# Altium project DIOT_PSU_AC_180.PrjPCB
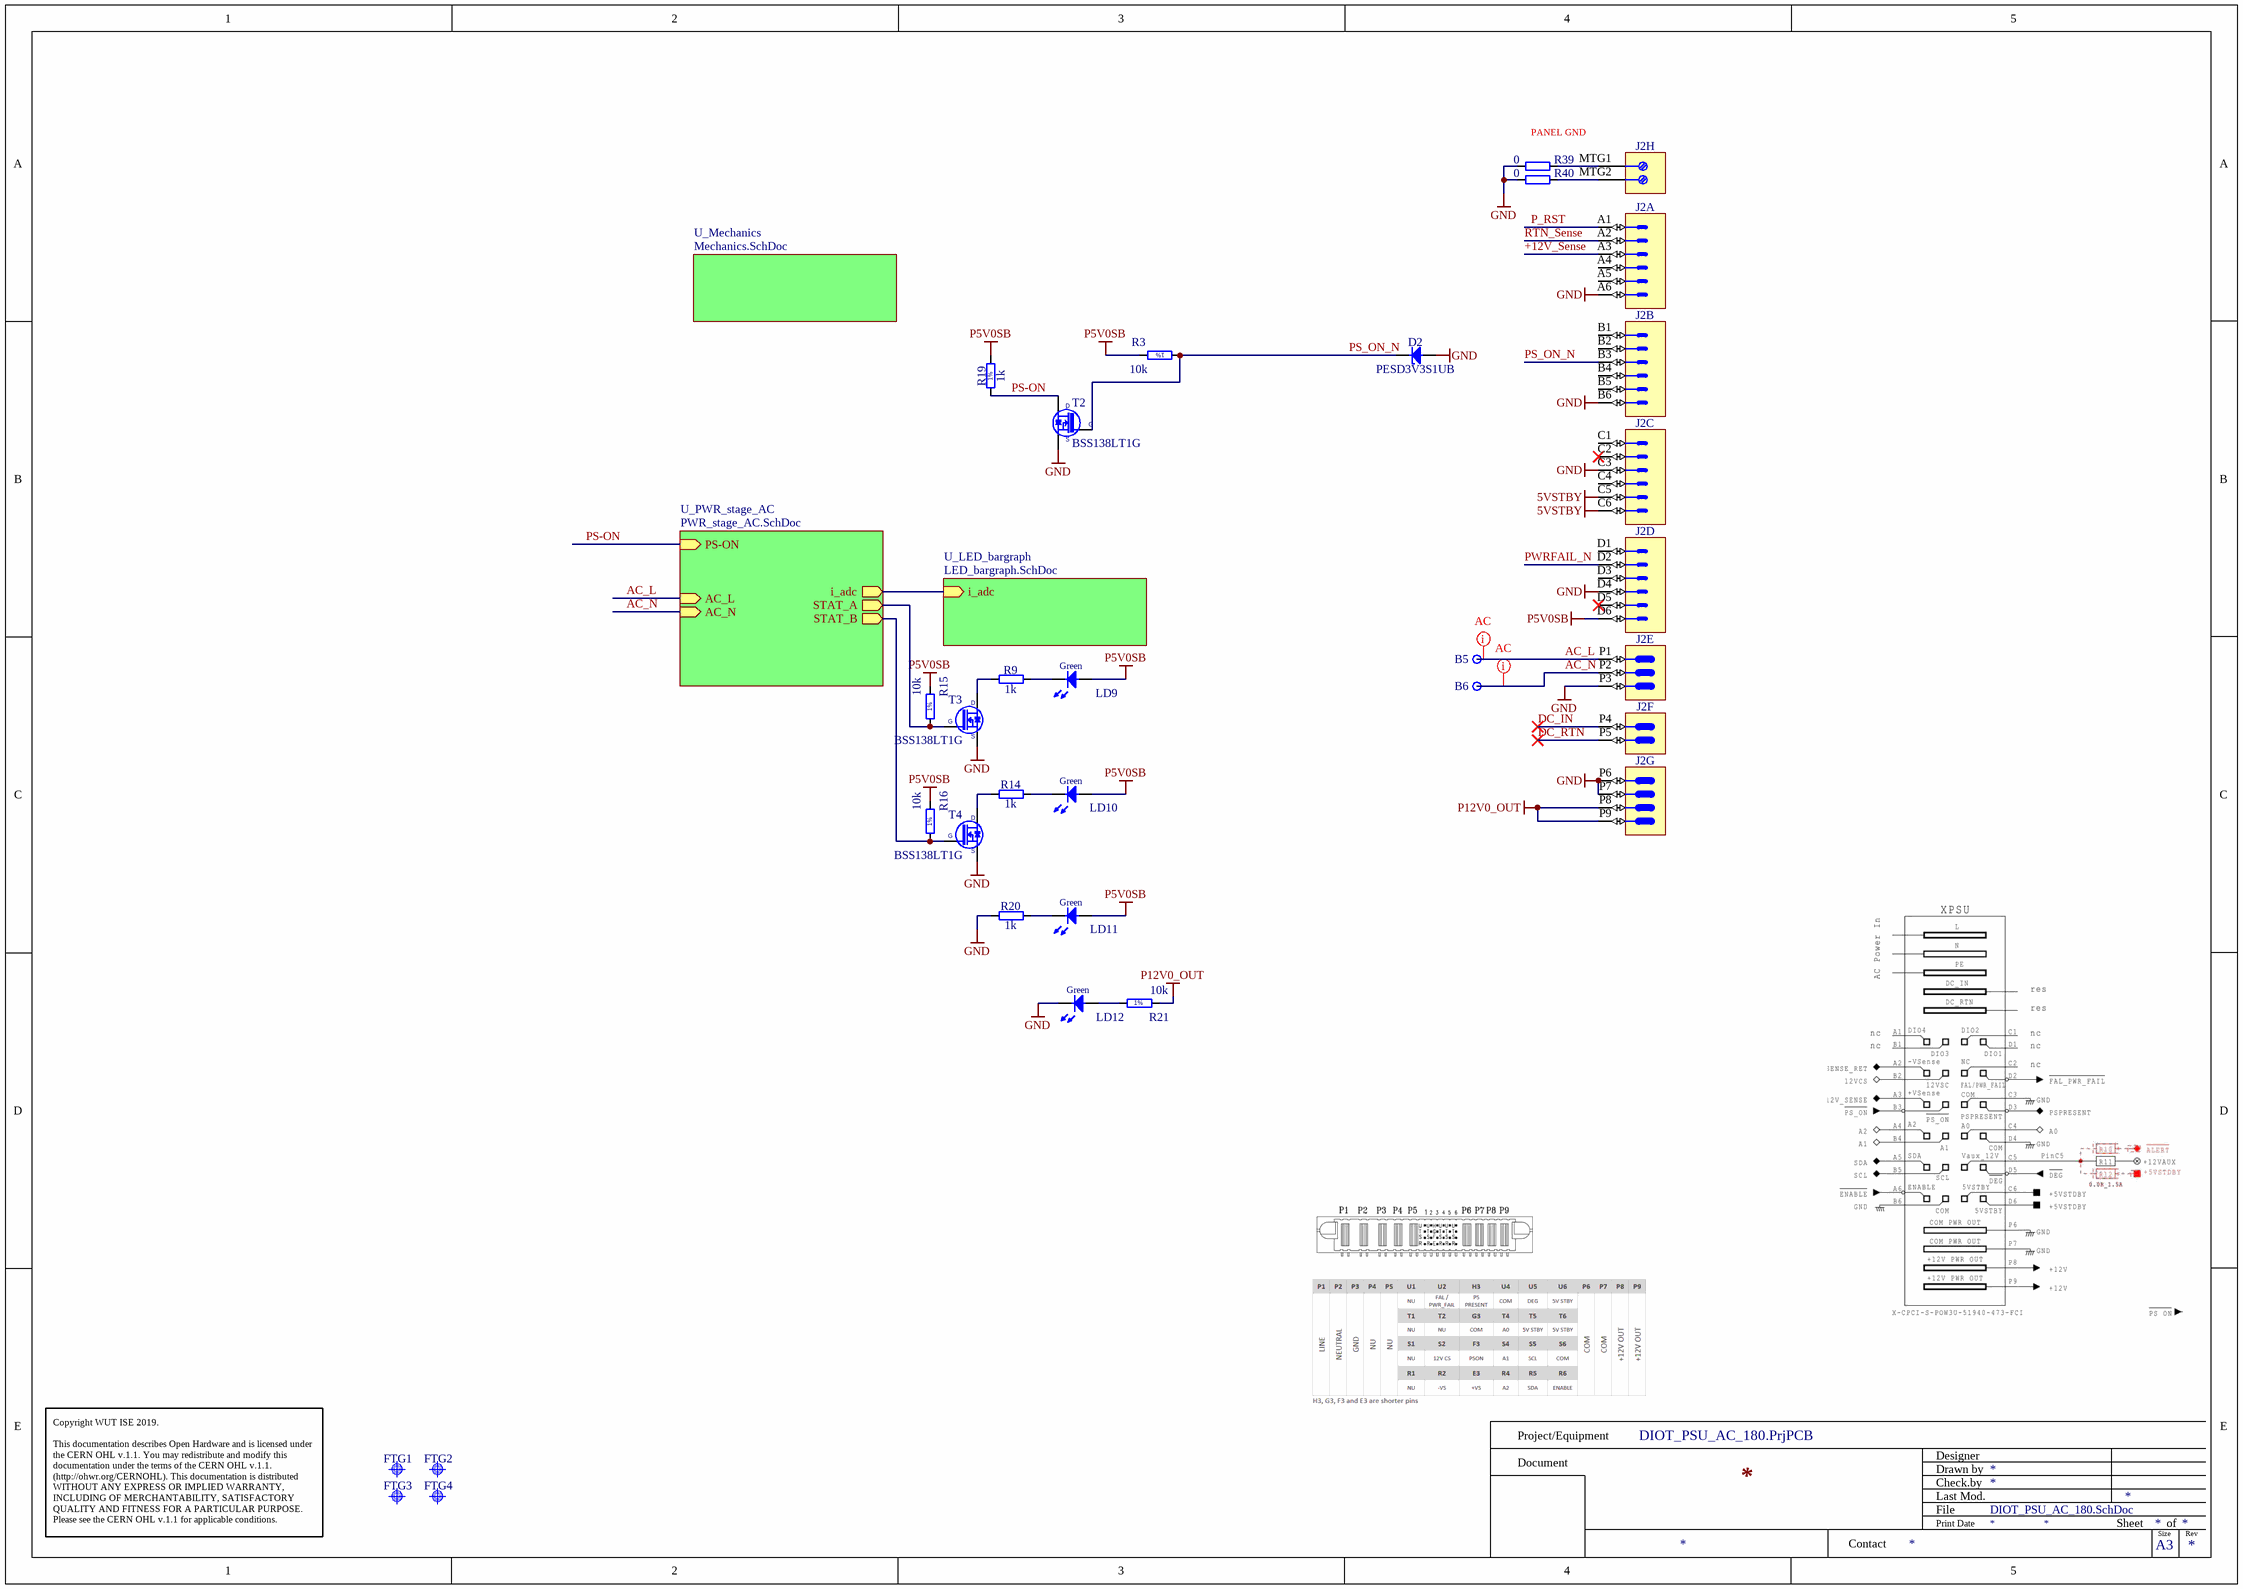
[diagram p0: DIOT_PSU_AC_180.SchDoc]
4 sheets, 97 parts. Net scope: hierarchical (ports join the sheet entries above them; power ports are global).
Board file: DIOT_PSU_AC_180.pcbdoc
Sheets:
  DIOT_PSU_AC_180.SchDoc
    U_PWR_stage_AC = PWR_stage_AC.SchDoc
    U_Mechanics = Mechanics.SchDoc
    U_LED_bargraph = LED_bargraph.SchDoc

## Sheet DIOT_PSU_AC_180.SchDoc
size 420 x 297 mm

### Parts
B5  Plated Hole  [c220h150]  (value not drawn)  (no BOM)
B6  Plated Hole  [c220h150]  (value not drawn)  (no BOM)
D2  PESD3V3S1UB  [SODFL1608X65N]
FTG1  Use only in PCB  [FIDUCIAL_TOP_C100-200]  (value not drawn)
FTG2  Use only in PCB  [FIDUCIAL_TOP_S100-200]  (value not drawn)
FTG3  Use only in PCB  [FIDUCIAL_TOP_C100-200]  (value not drawn)
FTG4  Use only in PCB  [FIDUCIAL_TOP_S100-200]  (value not drawn)
J2  PwrBlade  [AMPHENOL_51939-667]  (value not drawn)  (parts A,B,C,D,E,F,G,H of 8)
LD9  Green  [LED_AVAGO_HSME-C120]
LD10  Green  [LED_AVAGO_HSME-C120]
LD11  Green  [LED_AVAGO_HSME-C120]
LD12  Green  [LED_AVAGO_HSME-C120]
R3  10k  [RESC1005X40N]
R9  1k  [RESC1608X55N]
R14  1k  [RESC1608X55N]
R15  10k  [RESC1005X40N]
R16  10k  [RESC1005X40N]
R19  1k  [RESC1005X40N]
R20  1k  [RESC1608X55N]
R21  10k  [RESC1005X40N]
R39  0  [RESC1608X55N]
R40  0  [RESC1608X55N]
T2  BSS138LT1G  [SOT95P240X110-3N]
T3  BSS138LT1G  [SOT95P240X110-3N]
T4  BSS138LT1G  [SOT95P240X110-3N]

### Sub-sheets
U_LED_bargraph = LED_bargraph.SchDoc: i_adc (in)
U_Mechanics = Mechanics.SchDoc: no entries
U_PWR_stage_AC = PWR_stage_AC.SchDoc: PS-ON (in), i_adc (out), STAT_A (out), STAT_B (out), AC_L (in), AC_N (in)

### Nets
5VSTBY: J2.C5 J2.C6
GND: D2.2(A) J2.A6 J2.B6 J2.C3 J2.D4 J2.P3 J2.P6 J2.P7 LD12.1(C) R20.1 R39.2 R40.2 T2.2(S) T3.2(S) T4.2(S)
P5V0SB: J2.D6 LD9.2(A) LD10.2(A) LD11.2(A) R3.2 R15.2 R16.2 R19.2
P12V0_OUT: J2.P8 J2.P9 R21.2
+12V_Sense: J2.A3
AC_L: B5.1 J2.P1 ; sheet U_PWR_stage_AC/AC_L
AC_N: B6.1 J2.P2 ; sheet U_PWR_stage_AC/AC_N
DC_IN: J2.P4
DC_RTN: J2.P5
i_adc: sheet U_PWR_stage_AC/i_adc, sheet U_LED_bargraph/i_adc
P_RST: J2.A1
PS-ON: R19.1 T2.3(D) ; sheet U_PWR_stage_AC/PS-ON
PS_ON_N: D2.1(C) J2.B3 R3.1 T2.1(G)
PWRFAIL_N: J2.D2
RTN_Sense: J2.A2
NetIC1_4: R15.1 T3.1(G) ; sheet U_PWR_stage_AC/STAT_A
NetIC3_4: R16.1 T4.1(G) ; sheet U_PWR_stage_AC/STAT_B
NetJ2_MTG1: J2.MTG1 R39.1
NetJ2_MTG2: J2.MTG2 R40.1
NetLD9_1: LD9.1(C) R9.2
NetLD10_1: LD10.1(C) R14.2
NetLD11_1: LD11.1(C) R20.2
NetLD12_2: LD12.2(A) R21.1
NetR9_1: R9.1 T3.3(D)
NetR14_1: R14.1 T4.3(D)

Not connected (* = marked no-connect by the designer): J2 A4 A5 B1 B2 B4 B5 C1 C2* C4 D1 D3 D5*

### Layout directives
net class AC: AC_L, AC_N

### Notes on the sheet
- PANEL GND
- Project/Equipment
- Document
- Designer
- Drawn by
- Check.by
- Copyright WUT ISE 2019.
  This documentation describes Open Hardware and is licensed under the CERN OHL v.1.1. You may redistribute and modify this documentation under the terms of the CERN OHL v.1.1. (http://ohwr.org/CERNOHL). This documentation is distributed WITHOUT ANY EXPRESS OR IMPLIED WARRANTY, INCLUDING OF MERCHANTABILITY, SATISFACTORY QUALITY AND FITNESS FOR A PARTICULAR PURPOSE. Please see the CERN OHL v.1.1 for applicable conditions.
- Contact
- File
- Last Mod.
- Print Date
- Sheet
- Size
- A3
- of
- Rev
- (in symbol R0402_1K_1%_0.0625W_100PPM) 1%
- (in symbol R0402_10K_1%_0.0625W_100PPM) 1%

### Library data of the parts
B5 B6 = PLATED_HOLE1.5_PAD2.2: Single Terminal Socket; Part Description: Plated Through Hole: Hole Dia.=1.5mm Pad Dia.=2.2mm, IPC-7251 Level A; Mounted: No; Part Number: PLATED_HOLE1.5_PAD2.2; Component Type: Standard (No BOM); Pin Count: 1; Family: Plated Hole; Socket: No; SMD: No; Sense: No; Status: None; ComponentHeight: 0mm; HelpURL: Undefined; Author: CERN DEM JLC; CreateDate: 11.05.2017; LatestRevisionDate: 11.05.2017; PackageDescription: Plated Through Hole: Hole Dia.=1.5mm Pad Dia.=2.2mm, IPC-7251 Level A
D2 = PESD3V3S1UB: ESD protection diode; Part Description: ESD protection diode (23kV); Manufacturer: NXP SEMICONDUCTORS; Voltage: 3V3; Power: 330W; PressFit: No; Bonding: No; Part Number: PESD3V3S1UB; Component Kind: Standard; Component Type: Standard; Device: PESD3V3S1UB; PackageDescription: Ultra Small Outline Diode Flat Lead (SOD-523), Body; 1.2mm L X 0.8mm W X 0.65mm H, IPC Medium Density; Manufacturer Part Number: PESD3V3S1UB; Pin Count: 2; Case: SOD523; Mounted: Yes; Socket: No; SMD: Yes; Sense: No; ComponentHeight: 0.65mm; HelpURL: \\cern.ch\dfs\Applications\Altium\Datasheets\PESD3V3S1UB.pdf; Author: CERN DEM JLC; CreateDate: 29.11.2012; LatestRevisionDate: 29.11.2012
FTG1 FTG3 = FIDUCIAL_TARGET_C100-200: Fiducial Target; Part Description: Round Fiducial Target, Top Layer, 1.0mm, Top Solder 2.0mm, Keepout =2.0mm; Mounted: No; Part Number: FIDUCIAL_TARGET_C100-200; Component Kind: Standard (No BOM); Component Type: Standard (No BOM); Pin Count: 1; Family: Fiducial; Socket: No; SMD: Yes; Sense: No; Status: None; ComponentHeight: 0mm; HelpURL: Undefined; Author: CERN DEM JLC; CreateDate: 09.02.2010; LatestRevisionDate: 04.04.2012; PackageDescription: Round Fiducial Target, Top Layer, 1.0mm, Top Solder 2.0mm, Keepout =2.0mm
FTG2 FTG4 = FIDUCIAL_TARGET_S100-200: Fiducial Target; Part Description: Square Fiducial Target, Top Layer, 1.0mm, Top Solder 2.0mm, Keepout =2.0mm; Mounted: No; Part Number: FIDUCIAL_TARGET_S100-200; Component Kind: Standard (No BOM); Component Type: Standard (No BOM); Pin Count: 1; Family: Fiducial; Socket: No; SMD: Yes; Sense: No; Status: None; ComponentHeight: 0mm; HelpURL: Undefined; Author: CERN DEM JLC; CreateDate: 09.02.2010; LatestRevisionDate: 04.04.2012; PackageDescription: Square Fiducial Target, Top Layer, 1.0mm, Top Solder 2.0mm, Keepout =2.0mm
J2 = AMPHENOL_51939-667: Thru-Hole, Lead 3.43mm, PowerBlade Right Angled Power Connector 3ACP 2P 24S 4P Contacts; Part Description: Right Angle PowerBlade Power Connector 3ACP + 2P + 24S + 4P Contacts; PressFit: No; Part Number: AMPHENOL_51939-667; Component Kind: Standard; Component Type: Standard; Pin Count: 33; Family: PwrBlade; Mounted: Yes; Socket: No; SMD: No; Sense: No; Status: None; Manufacturer: AMPHENOL; Manufacturer Part Number: 51939-667; ComponentHeight: 12.57mm; HelpURL: \\cern.ch\dfs\Applications\Altium\Datasheets\AMPHENOL_51939-667.pdf; Author: CERN DEM JLC; CreateDate: 05.03.2019; LatestRevisionDate: 05.03.2019
LD9-LD12 = LED_AVAGO_HSME-C120: LED Green 1C 2A; Part Description: High Performance Right Angle Chip Green LED; Manufacturer: AVAGO TECHNOLOGIES; PressFit: No; Bonding: No; Part Number: LED_AVAGO_HSME-C120; Component Kind: Standard; Component Type: Standard; Color: Green; PackageDescription: Green Chip LED, 2-Leads, Body 1.7x1.1mm, Side Emitting Package; Manufacturer Part Number: HSME-C120; Pin Count: 2; Mounted: Yes; Socket: No; SMD: Yes; Sense: No; ComponentHeight: 0.7mm; HelpURL: \\cern.ch\dfs\Applications\Altium\Datasheets\LED_AVAGO_HSME-C120.pdf; ComponentLink1URL: \\cern.ch\dfs\Applications\Altium\Datasheets\LED_AVAGO_HSME-C110_DESIGN-GUIDE.pdf; ComponentLink1Description: Design Guide; Author: CERN DEM JMW; CreateDate: 22.07.2009; LatestRevisionDate: 20.06.2012
R3 R15 R16 R21 = R0402_10K_1%_0.0625W_100PPM: Resistor - 1%; Part Description: General Purpose Thick Film Chip Resistor; Manufacturer: GENERIC; Manufacturer1 Part Number: 232270671003L; TC: ±100ppm/°C; Table: Resistors SMD; Part Number: R0402_10K_1%_0.0625W_100PPM; Component Kind: Standard; Component Type: Standard; Pin Count: 2; Value: 10k; Status: Not recommended; Power: 0.0625W; Tolerance: ±1%; Manufacturer Part Number: R0402_10K_1%_0.0625W_100PPM; Case: 0402; Mounted: Yes; Socket: No; SMD: Yes; Manufacturer1 Example: YAGEO PHYCOMP; Manufacturer1 ComponentHeight: 0.4mm; HelpURL: \\cern.ch\dfs\Applications\Altium\Datasheets\R0402_Phycomp_RC0402.pdf; Author: CERN DEM JLC; CreateDate: 2007-12-03; LatestRevisionDate: 2012-10-17
R9 R14 R20 = R0603_1K_1%_0.1W_100PPM: Resistor - 1%; Part Description: General Purpose Thick Film Chip Resistor; Manufacturer: GENERIC; Manufacturer1 Part Number: NRC06F1001TRF; Power: 0.1W; TC: ±100ppm/°C; PressFit: No; Part Number: R0603_1K_1%_0.1W_100PPM; Component Kind: Standard; Component Type: Standard; Pin Count: 2; Value: 1k; Status: Preferred; Tolerance: ±1%; Manufacturer Part Number: R0603_1K_1%_0.1W_100PPM; Case: 0603; Mounted: Yes; Sense: No; Socket: No; SMD: Yes; Manufacturer1 Example: NIC COMPONENT; Manufacturer1 ComponentHeight: 0.55mm; HelpURL: \\cern.ch\dfs\Applications\Altium\Datasheets\R0603_NIC_NRC.pdf; Author: CERN DEM JLC; CreateDate: 03.12.2007; LatestRevisionDate: 13.03.2008
R19 = R0402_1K_1%_0.0625W_100PPM: Resistor - 1%; Part Description: General Purpose Thick Film Chip Resistor; Manufacturer: GENERIC; Manufacturer1 Part Number: 232270671002L; TC: ±100ppm/°C; PressFit: No; Part Number: R0402_1K_1%_0.0625W_100PPM; Component Kind: Standard; Component Type: Standard; Pin Count: 2; Value: 1k; Status: Not Recommended; Power: 0.0625W; Tolerance: ±1%; Manufacturer Part Number: R0402_1K_1%_0.0625W_100PPM; Case: 0402; Mounted: Yes; Sense: No; Socket: No; SMD: Yes; Manufacturer1 Example: YAGEO PHYCOMP; Manufacturer1 ComponentHeight: 0.4mm; HelpURL: \\cern.ch\dfs\Applications\Altium\Datasheets\R0402_Phycomp_RC0402.pdf; Author: CERN DEM JLC; CreateDate: 03.12.2007; LatestRevisionDate: 17.10.2012
R39 R40 = R0603_0R_JUMPER: Resistor; Part Description: 1A (0.05R Max DC Resistance) Zero Ohm Jumper; Manufacturer: GENERIC; Manufacturer1 Part Number: NRC06Z0; PressFit: No; Part Number: R0603_0R_JUMPER; Component Kind: Standard; Component Type: Standard; Pin Count: 2; Value: 0; Status: Preferred; Manufacturer Part Number: R0603_0R_JUMPER; Case: 0603; Mounted: Yes; Sense: No; Socket: No; SMD: Yes; Manufacturer1 Example: NIC COMPONENT; Manufacturer1 ComponentHeight: 0.55mm; HelpURL: \\cern.ch\dfs\Applications\Altium\Datasheets\R0603_NIC_NRC.pdf; Author: CERN DEM JLC; CreateDate: 03.12.2007; LatestRevisionDate: 13.03.2008
T2-T4 = BSS138LT1G: N-CHANNEL MOSFET WITH DIODE; Part Description: 50V 200mA N-Channel Enhancement Mode Field-Effect Transistor; Manufacturer: ON SEMICONDUCTOR; PressFit: No; Bonding: No; Part Number: BSS138LT1G; Component Kind: Standard; Component Type: Standard; Device: BSS138LT1G; PackageDescription: SOT23 3-Leads, Pitch 0.95mm - Body 1.4x3mm, IPC Medium Density; Manufacturer Part Number: BSS138LT1G; Pin Count: 3; Case: SOT23-3; Mounted: Yes; Socket: No; SMD: Yes; Sense: No; ComponentHeight: 1.11mm; HelpURL: \\cern.ch\dfs\Applications\Altium\Datasheets\BSS138LT1G.pdf; Author: CERN DEM JLC; CreateDate: 23.03.2009; LatestRevisionDate: 23.03.2009

## Sheet PWR_stage_AC.SchDoc
size 420 x 297 mm; SPICEModelCacheMYOJSQKR: <root> / <DocumentId>MYOJSQKR</DocumentId> / <CacheFrame Number="0"> / <Model Name="860080473007_120uf" Kind="CKT"> / <Text>******* / .subckt 860080473007_120uF 1 2 / Rser 1 3 0.1 / Lser 2 4 0.000000005 / C1 3 4 0.00012 / Rpar 3 4 833333.333333333 / .ends 860080473007_120uF</Text> / </Model> / </CacheFrame> / </root>
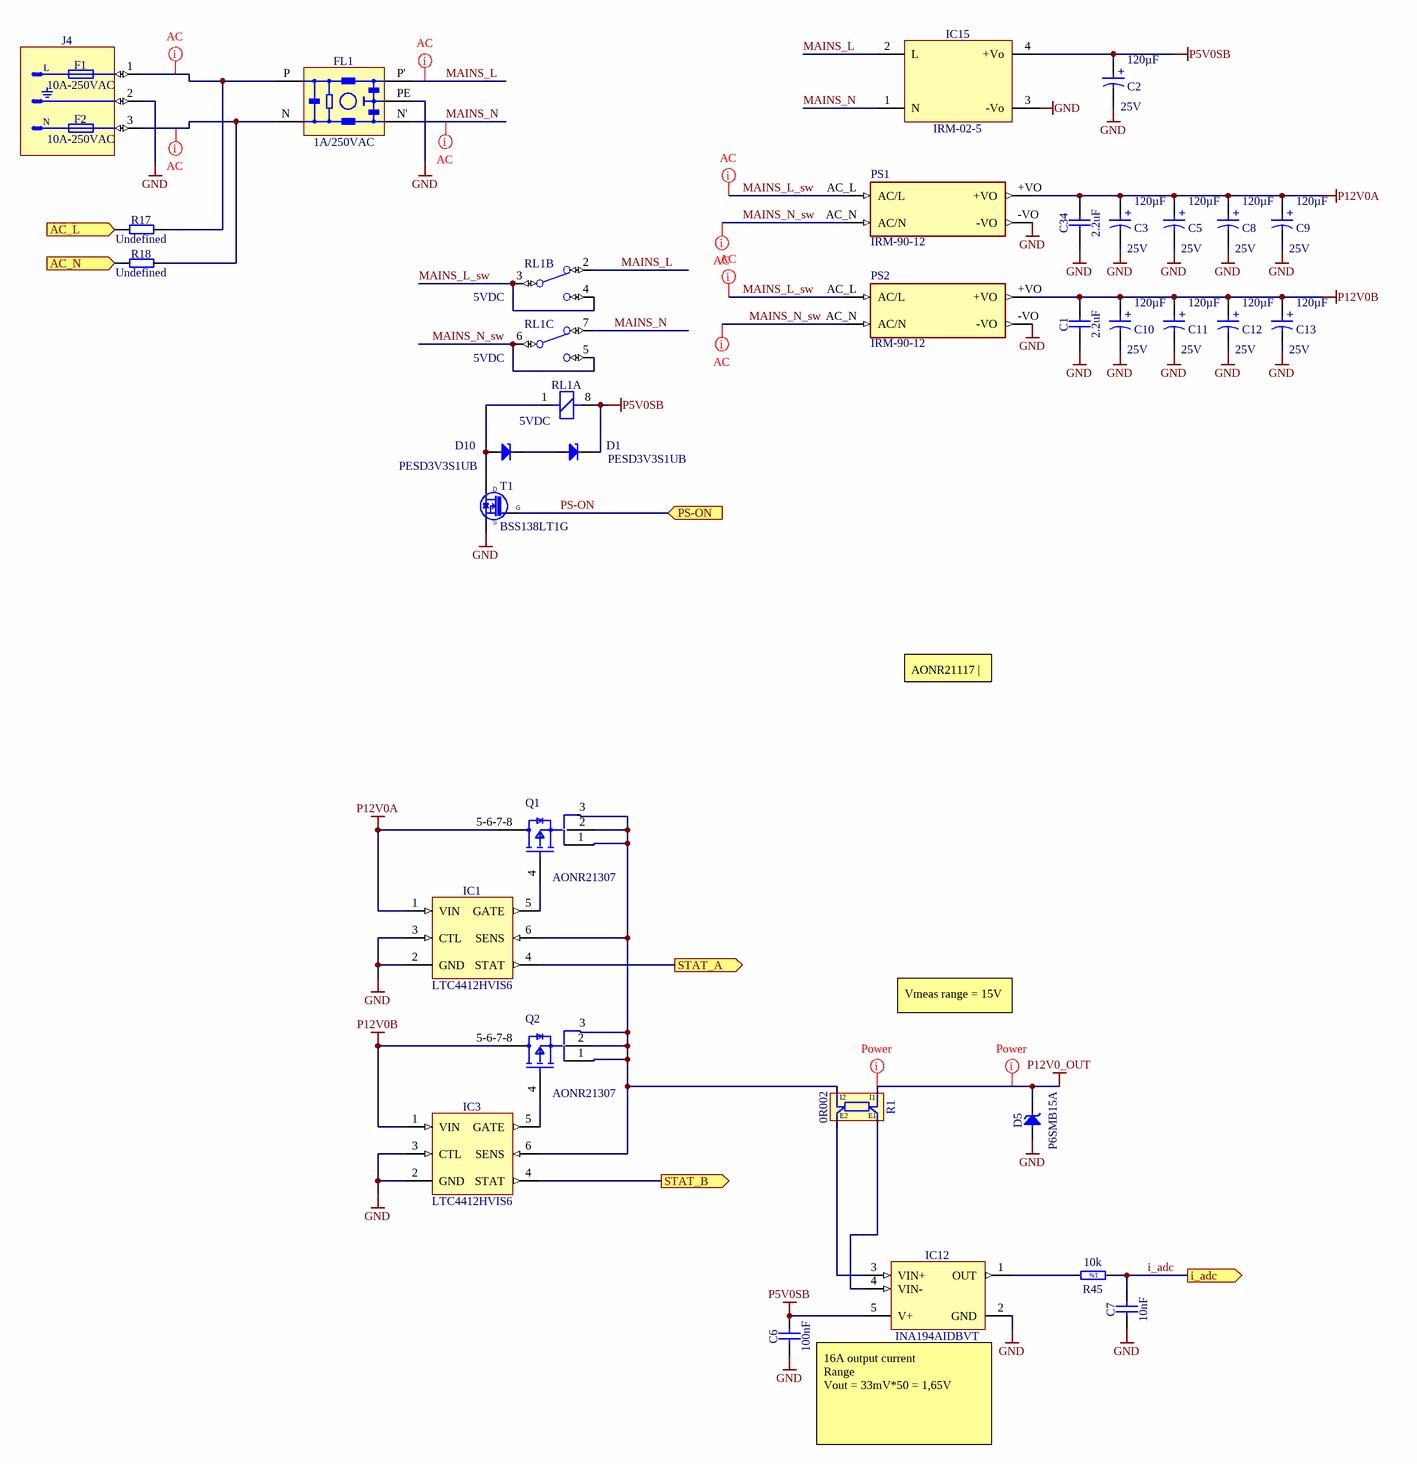
[diagram p1: PWR_stage_AC.SchDoc]

### Parts
C1  2.2uF  [CAPC2013X145N]
C2  Rated Voltage (DC): 25V  [WCAP-ATLI_D6.3H15]  (hidden comment: 120µF)
C3  Rated Voltage (DC): 25V  [WCAP-ATLI_D6.3H15]  (hidden comment: 120µF)
C5  Rated Voltage (DC): 25V  [WCAP-ATLI_D6.3H15]  (hidden comment: 120µF)
C6  100nF  [CAPC1005X55N]
C7  10nF  [CAPC1005X55N]
C8  Rated Voltage (DC): 25V  [WCAP-ATLI_D6.3H15]  (hidden comment: 120µF)
C9  Rated Voltage (DC): 25V  [WCAP-ATLI_D6.3H15]  (hidden comment: 120µF)
C10  Rated Voltage (DC): 25V  [WCAP-ATLI_D6.3H15]  (hidden comment: 120µF)
C11  Rated Voltage (DC): 25V  [WCAP-ATLI_D6.3H15]  (hidden comment: 120µF)
C12  Rated Voltage (DC): 25V  [WCAP-ATLI_D6.3H15]  (hidden comment: 120µF)
C13  Rated Voltage (DC): 25V  [WCAP-ATLI_D6.3H15]  (hidden comment: 120µF)
C34  2.2uF  [CAPC2013X145N]
D1  PESD3V3S1UB  [SODFL1608X65N]
D5  P6SMB15A  [DIOM5436X261N]
D10  PESD3V3S1UB  [SODFL1608X65N]
F1  10A-250VAC  [FUSE_5X20_GLASS_v]
F2  10A-250VAC  [FUSE_5X20_GLASS_v]
FL1  1A/250VAC  [FIL_SCHAFFNER_FN 406]
IC1  LTC4412HVIS6  [SOT95P280X100-6N]
IC3  LTC4412HVIS6  [SOT95P280X100-6N]
IC12  INA194AIDBVT  [SOT95P280X145-5N]
IC15  IRM-02-5  [PWS_MEANWELL_IRM-02]
J4  IEC  [SCHURTER_GSF1.2202.31]  (value not drawn)
PS1  IRM-90-12  [CONV_IRM-90-12]
PS2  IRM-90-12  [CONV_IRM-90-12]
Q1  AONR21307  [FP-DFN3x3A_8L_EP1_P-MFG]
Q2  AONR21307  [FP-DFN3x3A_8L_EP1_P-MFG]
R1  0R002  [RES_VISHAY_WSK2512_0R005-0R2]
R17  Undefined  [RESC6331X70N]
R18  Undefined  [RESC6331X70N]
R45  10k  [RESC1005X40N]
RL1  5VDC  [REL_OMRON_G2RL-2-5DC]  (parts A,B,C of 3)
T1  BSS138LT1G  [SOT95P240X110-3N]

### Ports
AC_L (in), AC_N (in), i_adc (out), PS-ON (in), STAT_A (out), STAT_B (out)

### Nets
GND: C1.1 C2.2(N) C3.2(N) C5.2(N) C6.1 C7.1 C8.2(N) C9.2(N) C10.2(N) C11.2(N) C12.2(N) C13.2(N) C34.1 D5.2(A) FL1.PE IC1.2(GND) IC1.3(CTL) IC3.2(GND) IC3.3(CTL) IC12.2(GND) IC15.3(-Vo) J4.2 PS1.-VO PS2.-VO T1.2(S)
P5V0SB: C2.1(P) C6.2 D1.1(C) IC12.5(V+) IC15.4(+Vo) RL1.8
P12V0_OUT: D5.1(C) R1.I1
P12V0A: C3.1(P) C5.1(P) C8.1(P) C9.1(P) C34.2 IC1.1(VIN) PS1.+VO Q1.5-6-7-8(D)
P12V0B: C1.2 C10.1(P) C11.1(P) C12.1(P) C13.1(P) IC3.1(VIN) PS2.+VO Q2.5-6-7-8(D)
AC_L: R17.1 ; port AC_L
AC_N: R18.1 ; port AC_N
i_adc: C7.2 R45.1 ; port i_adc
MAINS_L: FL1.P' IC15.2(L) RL1.2(NC)
MAINS_L_sw: PS1.AC_L(AC/L) PS2.AC_L(AC/L) RL1.3(C) RL1.4(NO)
MAINS_N: FL1.N' IC15.1(N) RL1.7(NC)
MAINS_N_sw: PS1.AC_N(AC/N) PS2.AC_N(AC/N) RL1.5(NO) RL1.6(C)
PS-ON: T1.1(G) ; port PS-ON
NetD1_2: D1.2(A) D10.1(C)
NetD10_2: D10.2(A) RL1.1 T1.3(D)
NetFL1_N: FL1.N J4.3 R18.2
NetFL1_P: FL1.P J4.1 R17.2
NetIC1_4: IC1.4(STAT) ; port STAT_A
NetIC1_5: IC1.5(GATE) Q1.4(G)
NetIC1_6: IC1.6(SENS) IC3.6(SENS) Q1.1(S) Q1.2(S) Q1.3(S) Q2.1(S) Q2.2(S) Q2.3(S) R1.I2
NetIC3_4: IC3.4(STAT) ; port STAT_B
NetIC3_5: IC3.5(GATE) Q2.4(G)
NetIC12_1: IC12.1(OUT) R45.2
NetIC12_3: IC12.3(VIN+) R1.E2
NetIC12_4: IC12.4(VIN-) R1.E1

### Layout directives
net class Power: P12V0_OUT
net class AC: MAINS_L, MAINS_L_sw, MAINS_N, MAINS_N_sw, NetFL1_N, NetFL1_P

### Notes on the sheet
- AONR21117 | Tranzystor: P-MOSFET; unipolarny; 20V; 26,5A; 5W; DFN8
  AONR21117
- Vmeas range = 15V
- 16A output current
  Range
  Vout = 33mV*50 = 1,65V
- Project/Equipment
- Document
- Designer
- Drawn by
- Check.by
- Copyright WUT ISE 2020.
  This documentation describes Open Hardware and is licensed under the CERN OHL v.1.2. You may redistribute and modify this documentation under the terms of the CERN OHL v.1.2. (http://ohwr.org/CERNOHL). This documentation is distributed WITHOUT ANY EXPRESS OR IMPLIED WARRANTY, INCLUDING OF MERCHANTABILITY, SATISFACTORY QUALITY AND FITNESS FOR A PARTICULAR PURPOSE. Please see the CERN OHL v.1.2 for applicable conditions.
- Contact
- File
- Last Mod.
- Print Date
- Sheet
- Size
- A3
- of
- Rev
- (in symbol 860080473007) +
- (in symbol R0402_10K_1%_0.0625W_100PPM) 1%
- (in symbol SCHURTER_GSF1.2202.31) L; N

### Library data of the parts
C1 C34 = CC0805_2.2UF_35V_10%_X7R_TDK_CGA4J1X7R1V225K125AC: Non-polarised capacitor; Part Description: SMD Multilayer Chip Ceramic Capacitor (Automotive Grade); Manufacturer: TDK; Voltage: 35V; TC: X7R; Tolerance: ±10%; Part Number: CC0805_2.2UF_35V_10%_X7R_TDK_CGA4J1X7R1V225K125AC; Component Kind: Standard; Component Type: Standard; Pin Count: 2; Value: 2.2uF; Status: Not Recommended; Manufacturer Part Number: CGA4J1X7R1V225K125; Case: 0805; Mounted: Yes; Socket: No; SMD: Yes; Sense: No; ComponentHeight: 1.45mm; HelpURL: \\cern.ch\dfs\Applications\Altium\Datasheets\CC0805_X7R_TDK_CGA.pdf; Author: CERN DEM BC; CreateDate: 26.02.2016; LatestRevisionDate: 13.09.2016
C2 C3 C5 C8-C13 = 860080473007: WCAP-ATLI Aluminum Electrolytic Capacitor, Radial, THT, D6.3 x H15mm, 120µF, 25V; Manufacturer: Wurth Elektronik; Capacitance Tolerance: +/-20%; Dissipation Factor: 10%; Endurance: 2000h; Leakage Current: 30µA; Ripple Current: 490mA; Technical Reference: ATED150121M025DSPA4B000; Manufacturer Part Number: 860080473007; Category: Aluminum Electrolytic Capacitors; Match Code: WCAP-ATLI; ComponentLink1Description: Website Link; ComponentLink1URL: https://www.we-online.com/redexpert/article/860080473007?ad; ComponentLink2Description: Datasheet Link; ComponentLink2URL: https://www.we-online.com/redexpert/spec/860080473007?ad; Mount: Through Hole; Operating Temperature Max: 105°C; Operating Temperature Min: -55°C; Packaging: Ammo Pack; Height: 15mm; Diameter: 6.3mm; Capacitance: 120µF
C6 = CC0402_100NF_25V_10%_X7R_YUDEN_TMK105B7104KVHF: Non-polarised capacitor; Part Description: SMD Multilayer Chip Ceramic Capacitor (High Dielectric Type) for Automotive / Industrial Applications; Manufacturer: TAIYO YUDEN; Voltage: 25V; TC: X7R; Tolerance: ±10%; Part Number: CC0402_100NF_25V_10%_X7R_YUDEN_TMK105B7104KVHF; Component Kind: Standard; Component Type: Standard; Pin Count: 2; Value: 100nF; Status: Not Recommended; Manufacturer Part Number: TMK105B7104KVHF; Case: 0402; Mounted: Yes; Socket: No; SMD: Yes; Sense: No; HelpURL: \\cern.ch\dfs\Applications\Altium\Datasheets\CC0402_TAIYO-YUDEN_TMK105B7104KVHF.pdf; Author: CERN DEM JLC; CreateDate: 10/05/2017; LatestRevisionDate: 10/05/2017; ComponentHeight: 0.55mm
C7 = CC0402_10NF_50V_10%_X7R: Non-polarised capacitor; Part Description: SMD Multilayer Chip Ceramic Capacitor; Manufacturer: GENERIC; Manufacturer1 Part Number: GRM155R71H103KA88D; Voltage: 50V; TC: X7R; Tolerance: ±10%; Part Number: CC0402_10NF_50V_10%_X7R; Component Kind: Standard; Component Type: Standard; Pin Count: 2; Value: 10nF; Status: None; Manufacturer Part Number: CC0402_10NF_50V_10%_X7R; Case: 0402; Mounted: Yes; Socket: No; SMD: Yes; Sense: No; Manufacturer1 Example: MURATA; Manufacturer1 ComponentHeight: 0.55mm; HelpURL: \\cern.ch\dfs\Applications\Altium\Datasheets\CC0402_X7R_MURATA_GRM.pdf; Author: CERN DEM MR; CreateDate: 08/01/2016; LatestRevisionDate: 08/01/2016
D1 D10 = PESD3V3S1UB: as D2 on sheet DIOT_PSU_AC_180; Part Number: PESD3V3S1UB; Component Kind: Standard; Component Type: Standard; Device: PESD3V3S1UB; PackageDescription: Ultra Small Outline Diode Flat Lead (SOD-523), Body; 1.2mm L X 0.8mm W X 0.65mm H, IPC Medium Density; Manufacturer Part Number: PESD3V3S1UB; Pin Count: 2; Case: SOD523; Mounted: Yes; Socket: No; SMD: Yes; Sense: No; ComponentHeight: 0.65mm; HelpURL: \\cern.ch\dfs\Applications\Altium\Datasheets\PESD3V3S1UB.pdf; Author: CERN DEM JLC; CreateDate: 29.11.2012; LatestRevisionDate: 29.11.2012
D5 = P6SMB15A: Transient Voltage Suppressor Diode (Uni-Directional); Part Description: Uni-directional Transient Voltage Suppressor (TVS) Diode; Manufacturer: LITTELFUSE; Voltage: 15V; Power: 600W; PressFit: No; Bonding: No; Part Number: P6SMB15A; Component Kind: Standard; Component Type: Standard; Device: P6SMB15A; PackageDescription: DO-214-AA/SMB Diode, Molded Body; 5.40mm L X 3.62mm W X 2.61mm H, IPC Medium Density; Manufacturer Part Number: P6SMB15A; Pin Count: 2; Case: SMB; Mounted: Yes; Socket: No; SMD: Yes; Sense: No; ComponentHeight: 2.61mm; HelpURL: \\cern.ch\dfs\Applications\Altium\Datasheets\P6SMB15A.pdf; Author: CERN DEM JLC; CreateDate: 12.07.2017; LatestRevisionDate: 12.07.2017
F1 F2 = FUSE_SCHURTER_0034.3127_v: Fuse; Part Description: Cylindrical 5x20 mm, Time-Lag T Miniature Fuse, FST Series; PressFit: No; Part Number: FUSE_SCHURTER_0034.3127_v; Component Kind: Accessories; Component Type: Standard; Pin Count: 0; PackageDescription: 5x20mm Cylindrical Fuse, SCHURTER FST5X20 Series; Family: Fuse; Mounted: Yes; Socket: Yes; SMD: No; Sense: No; Value: 10A-250VAC; Manufacturer: SCHURTER; Manufacturer Part Number: 0034.3127; ComponentHeight: 20.5mm; HelpURL: \\cern.ch\dfs\Applications\Altium\Datasheets\FUSE_SCHURTER_FST5X20.pdf; Author: CERN DEM JLC; CreateDate: 28.01.2013; LatestRevisionDate: 28.01.2013
FL1 = FIL_SCHAFFNER_FN 406-1-02: 0.6 to 8.4A 230VAC Single Phase Ultra Compact EMC Filter; Part Number: FIL_SCHAFFNER_FN406-3-02; Manufacturer Part Number: FN406-3-02; Component Kind: Standard; Component Type: Standard; Pin Count: 5; Value: 1A/250VAC; Part Description: Single Phase Ultra Compact EMC Filter; Manufacturer: SCHAFFNER; Case: L45 W15 H28; Mounted: Yes; Socket: No; SMD: No; Sense: No; ComponentHeight: 28mm; HelpURL: \\cern.ch\dfs\Applications\Altium\Datasheets\FIL_SCHAFFNER_FN 406-1-02.pdf; Author: CERN DEM JLC; CreateDate: 24.05.2017; LatestRevisionDate: 24.05.2017
IC1 IC3 = LTC4412HVIS6#PBF: 36V, Low Loss PowerPathTM Controller in ThinSOT; Part Description: 36V, Low Loss PowerPath Controller in ThinSOT; Manufacturer: LINEAR TECHNOLOGY; PressFit: No; Bonding: No; Part Number: LTC4412HVIS6#PBF; Component Kind: Standard; Component Type: Standard; Device: LTC4412HVIS6; PackageDescription: SOT, 0.95mm Pitch; 6 Pin, 1.625mm W X 2.90mm L X 1.00mm H body, IPC Medium Density; Manufacturer Part Number: LTC4412HVIS6; Pin Count: 6; Case: SOT23-6; Mounted: Yes; Socket: No; SMD: Yes; Sense: No; ComponentHeight: 1mm; Author: CERN DEM JLC; HelpURL: \\cern.ch\dfs\Applications\Altium\Datasheets\LTC4412HVIS6#PBF.pdf; CreateDate: 22.03.2018; LatestRevisionDate: 02.02.2022
IC12 = INA194AIDBVT: Current Shunt Monitor -16V to +80V Common-Mode Range; Manufacturer: TEXAS INSTRUMENTS; PressFit: No; Bonding: No; Part Number: INA194AIDBVT; Component Kind: Standard; Component Type: Standard; Device: INA194AIDBVT; PackageDescription: SOT, 0.95mm pitch; 5 pin, 1.60mm W X 2.90mm L X 1.45mm H body, IPC Medium Density; Part Description: Current Shunt Monitor -16V to +80V Common-Mode Range; Manufacturer Part Number: INA194AIDBVT; Pin Count: 5; Case: SOT23-5; Mounted: Yes; Socket: No; SMD: Yes; Sense: No; ComponentHeight: 1.45mm; Author: CERN DEM JLC; HelpURL: \\cern.ch\dfs\Applications\Altium\Datasheets\INA194AIDBVT.pdf; CreateDate: 10.05.2010; LatestRevisionDate: 10.05.2010
IC15 = AC_DC_IRM-02-5: Power Supply; Part Description: 85-305VAC to 5VDC (400mA) 2W Power Supply; Manufacturer: MEAN WELL; PressFit: No; Bonding: No; Part Number: IRM-02-5; Component Kind: Standard; Component Type: Standard; Device: IRM-02-5; PackageDescription: IRM-02 Series, Body 33.7x22.2mm, Power Supply; Status: None; Manufacturer Part Number: IRM-02-5; Pin Count: 4; Mounted: Yes; Socket: No; SMD: No; Sense: No; ComponentHeight: 15mm; HelpURL: \\cern.ch\dfs\Applications\Altium\Datasheets\IRM-02-24.pdf; Author: GK; CreateDate: 14.02.2018; LatestRevisionDate: 14.02.2018
J4 = SCHURTER_GSF1.2202.31: Connector 3 Male 2P+ 2 Fuse Holder; Part Number: SCHURTER_GSF1.2201.31; Part Description: 10A 250Vac Sandwich Panel Mount (1.5mm) Inlet IEC Connector With 2 Fuseholder 5x20mm And Snap-in PCB Mount; Manufacturer Part Number: GSF1.2201.31; PressFit: No; Component Kind: Standard; Component Type: Standard; Footprint: SCHURTER_GSF1.2201.31; Pin Count: 3; Family: IEC; Mounted: Yes; Socket: No; SMD: No; Sense: No; Status: None; Manufacturer: SCHURTER; ComponentHeight: 24.45mm; HelpURL: \\cern.ch\dfs\Applications\Altium\Datasheets\SCHURTER_GSF1.2202.31.pdf; Author: CERN DEM JMW; CreateDate: 20.09.2012; LatestRevisionDate: 20.09.2012
PS1 PS2 = AC_DC_IRM-90-12: MF: {'manufacturer': u'MEAN WELL USA Inc.'}; Package: None; Price: None; Value: *; MP: IRM-90-12; Availability: Unavailable
Q1 Q2 = CMP-83955-000002-1: MOSFET P-CH 30V 3X3 DFN; Manufacturer: Alpha & Omega Semiconductor; Reverse Recovery Time: 13.3ns; Reverse Recovery Charge: 20nC; Turn Off Delay Time: 43.5ns; Max Forward Diode Voltage: -1V; Gate Charge At Vgs: 35nC @ -10V; Threshold Vgs Min: -1.3V; Gate To Source Voltage: 25V; Turn On Delay Time: 11ns; Continuous Drain Current: -24A; Power Dissipation: 5W; Max Junction Temp: +150°C; Number Of P Channels: 1; Drain To Source Voltage: -30V; Standoff Height: 0mm; Input Capacitace At Vds: 1995pF @ -15V; Depletion Mode: False; Threshold Vgs Max: -2.3V; Rthja Max: 45°C/W; Drain To Source Resistance: 9.2mΩ; Pulse Drain Current: -82A; Typ Forward Diode Voltage: -0.7V; Temperature Range Low: -55°C; Device Class L1: Discrete Semiconductors; Footprint Url: http://www.aosmd.com/res/packaging_information/DFN3x3A_8L_EP1_P.pdf; ComponentLink2Description: Datasheet; Device Class L2: Transistors; ComponentLink2URL: http://www.aosmd.com/res/data_sheets/AONR21307.pdf; Automotive: No; Temperature: -55°C to +150°C; Octopart: https://octopart.com/aonr21307-alpha+%26+omega+semiconductor-96014004; RoHS: TRUE; Digikey Description: MOSFET P-CH 30V 3X3 DFN; Drain To Source Breakdown Voltage: -30V; Package: DFN3x3A_8L_EP1_P; Manufacturer Part Number: AONR21307; Category: Trans; Height: 0.9mm; Lead Free: Yes; Device Class L3: MOSFETs; Temperature Range High: +150°C; Number Of Channels: 1
R1 = R2512_0R002_1%_1W_35PPM_VISHAY_WSK: Power and Current Sensing Resistor; Part Description: Power Metal Strip® Resistor, Low Value; Manufacturer: VISHAY DALE; Manufacturer Part Number: WSK25122L000FEA; Power: 1W; TC: ±35ppm/°C; Tolerance: ±1%; PressFit: No; Part Number: R2512_0R002_1%_1W_35PPM_VISHAY_WSK; Component Kind: Standard; Component Type: Standard; Pin Count: 4; Value: 0R002; Status: None; Case: 2512; Mounted: Yes; Sense: No; Socket: No; SMD: Yes; ComponentHeight: 0.89mm; HelpURL: \\cern.ch\dfs\Applications\Altium\Datasheets\R2512_VISHAY_WSK.pdf; Author: CERN DEM MR; CreateDate: 08.11.2016; LatestRevisionDate: 19.02.2018
R17 R18 = R2512_NO-VALUE: Resistor; Part Description: Reserved Footprint For a 2512 (6332) Chip Resistor; PressFit: No; Mounted: No; Part Number: R2512_NO-VALUE; Component Kind: Standard; Component Type: Standard; Pin Count: 2; Value: Undefined; Status: None; Manufacturer: Undefined; Manufacturer Part Number: R2512_NO-VALUE; Case: 2512; Sense: No; Socket: No; SMD: Yes; Manufacturer1 Example: Undefined; Manufacturer1 Part Number: Undefined; Manufacturer1 ComponentHeight: Undefined; HelpURL: Undefined; Author: CERN DEM JLC; CreateDate: 01.04.2014; LatestRevisionDate: 01.04.2014
R45 = R0402_10K_1%_0.0625W_100PPM: Resistor - 1%; Part Description: General Purpose Thick Film Chip Resistor; Manufacturer: GENERIC; Manufacturer1 Part Number: 232270671003L; TC: ±100ppm/°C; PressFit: No; Part Number: R0402_10K_1%_0.0625W_100PPM; Component Kind: Standard; Component Type: Standard; Pin Count: 2; Value: 10k; Status: Not Recommended; Power: 0.0625W; Tolerance: ±1%; Manufacturer Part Number: R0402_10K_1%_0.0625W_100PPM; Case: 0402; Mounted: Yes; Sense: No; Socket: No; SMD: Yes; Manufacturer1 Example: YAGEO PHYCOMP; Manufacturer1 ComponentHeight: 0.4mm; HelpURL: \\cern.ch\dfs\Applications\Altium\Datasheets\R0402_Phycomp_RC0402.pdf; Author: CERN DEM JLC; CreateDate: 03/12/2007; LatestRevisionDate: 17/10/2012
RL1 = REL_OMRON_G2RL-24: DPDT Power Relay, G2RL Series; Manufacturer: OMRON ELECTRONIC; Manufacturer Part Number: G2RL-2-5DC; PressFit: No; Part Number: REL_OMRON_G2RL-2-5DC; Component Kind: Standard; Component Type: Standard; Pin Count: 8; PackageDescription: 8 Leads, Row Spacing 7.5mm; Body 29mm x 12.7mm, OMRON_G2RL Series; Mounted: Yes; Socket: No; SMD: No; Sense: No; Status: None; Value: 5VDC; Part Description: DPDT Power Relay, G2RL Series; ComponentHeight: 15.7mm; HelpURL: \\cern.ch\dfs\Applications\Altium\Datasheets\REL_OMRON_G2RL-24.pdf; Author: GK; CreateDate: 16.06.2015; LatestRevisionDate: 16.06.2015
T1 = BSS138LT1G: as T2 on sheet DIOT_PSU_AC_180; Part Number: BSS138LT1G; Component Kind: Standard; Component Type: Standard; Device: BSS138LT1G; PackageDescription: SOT23 3-Leads, Pitch 0.95mm - Body 1.4x3mm, IPC Medium Density; Manufacturer Part Number: BSS138LT1G; Pin Count: 3; Case: SOT23-3; Mounted: Yes; Socket: No; SMD: Yes; Sense: No; ComponentHeight: 1.11mm; HelpURL: \\cern.ch\dfs\Applications\Altium\Datasheets\BSS138LT1G.pdf; Author: CERN DEM JLC; CreateDate: 23.03.2009; LatestRevisionDate: 23.03.2009

## Sheet Mechanics.SchDoc
size A4
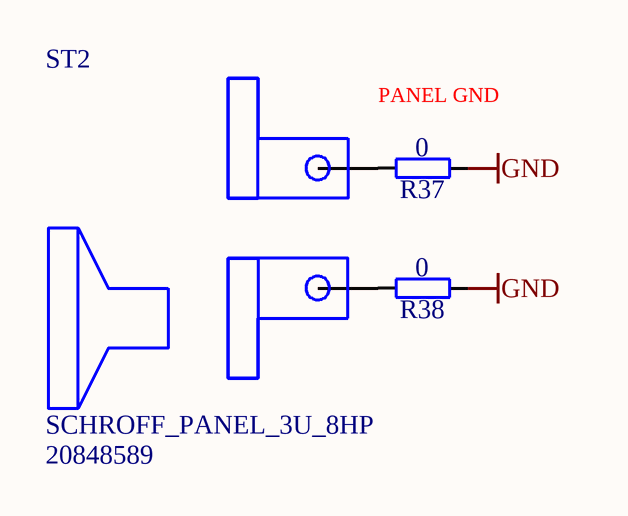
[diagram p2: Mechanics.SchDoc]

### Parts
R37  0  [RESC1608X55N]
R38  0  [RESC1608X55N]
ST2  SCHROFF_PANEL_3U_8HP  Manufacturer Part Number 2: 20848589  [SCHROFF_PANEL_3HP_8U_CPCIS_AC_PSU]

### Nets
GND: R37.1 R38.1
NetR37_2: R37.2 ST2.1
NetR38_2: R38.2 ST2.0

### Notes on the sheet
- PANEL GND

### Library data of the parts
R37 R38 = R0603_0R_JUMPER: as R39 on sheet DIOT_PSU_AC_180; Part Number: R0603_0R_JUMPER; Component Kind: Standard; Component Type: Standard; Pin Count: 2; Value: 0; Status: Preferred; Manufacturer Part Number: R0603_0R_JUMPER; Case: 0603; Mounted: Yes; Sense: No; Socket: No; SMD: Yes; Manufacturer1 Example: NIC COMPONENT; Manufacturer1 ComponentHeight: 0.55mm; HelpURL: \\cern.ch\dfs\Applications\Altium\Datasheets\R0603_NIC_NRC.pdf; Author: CERN DEM JLC; CreateDate: 03.12.2007; LatestRevisionDate: 13.03.2008
ST2 = SCHROFF_PANEL_3U_8HP_CPCIS_PSU: Schroff 8HP 4U EUROCARD Panel with ejector; Manufacturer: Schroff; Manufacturer Part Number: 20848589

## Sheet LED_bargraph.SchDoc
size A3
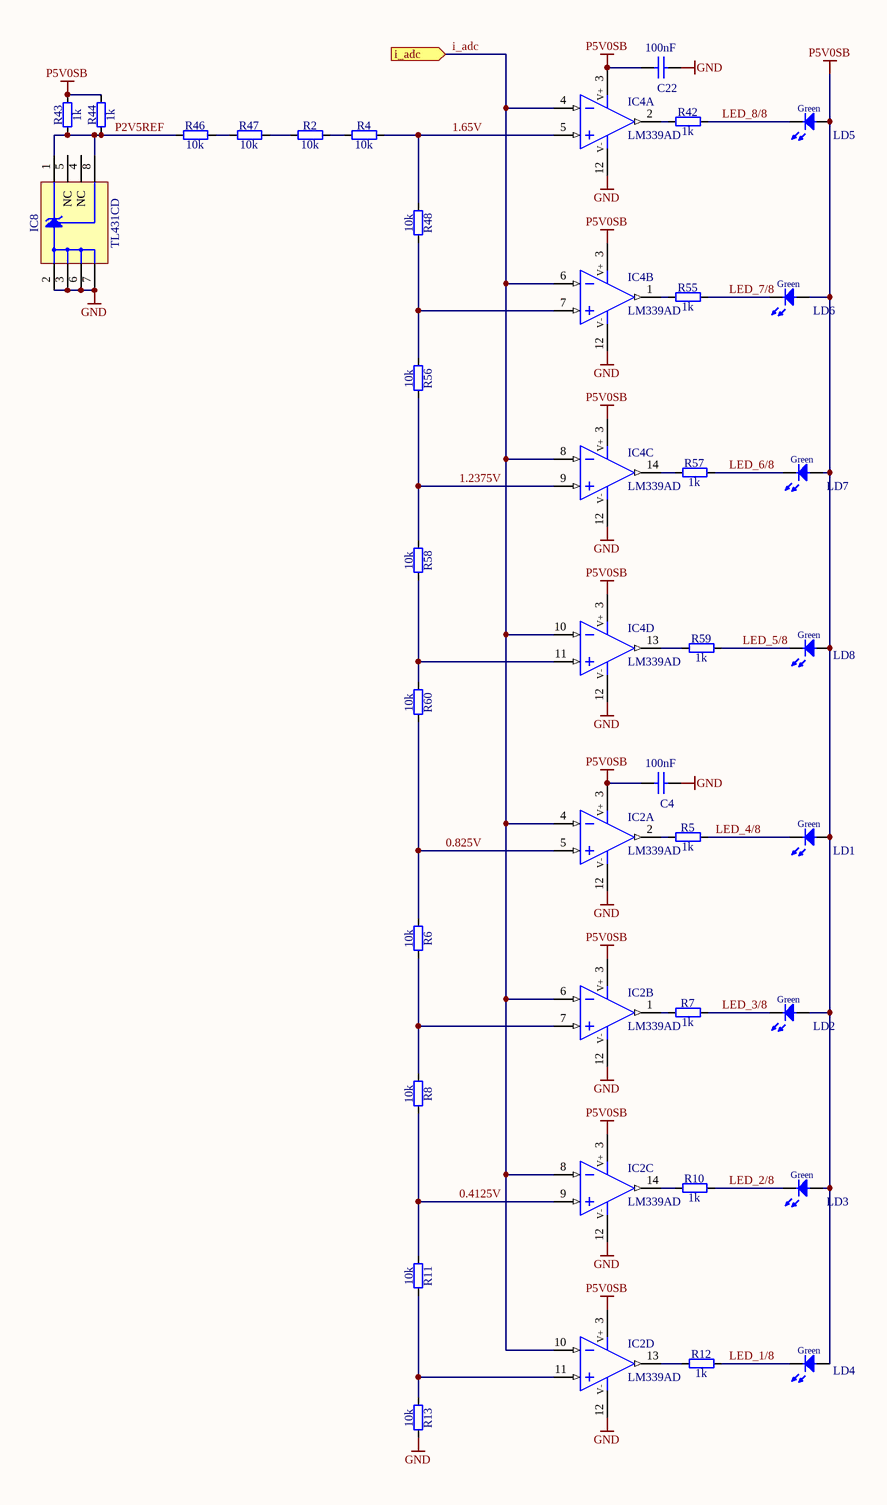
[diagram p3: LED_bargraph.SchDoc]

### Parts
C4  100nF  [CAPC1005X55N]
C22  100nF  [CAPC1005X55N]
IC2  LM339AD  [SOIC127P600X175-14N]  (parts A,B,C,D of 4)
IC4  LM339AD  [SOIC127P600X175-14N]  (parts A,B,C,D of 4)
IC8  TL431CD  [SOIC127P600X175-8N]
LD1  Green  [LED_AVAGO_HSME-C120]
LD2  Green  [LED_AVAGO_HSME-C120]
LD3  Green  [LED_AVAGO_HSME-C120]
LD4  Green  [LED_AVAGO_HSME-C120]
LD5  Green  [LED_AVAGO_HSME-C120]
LD6  Green  [LED_AVAGO_HSME-C120]
LD7  Green  [LED_AVAGO_HSME-C120]
LD8  Green  [LED_AVAGO_HSME-C120]
R2  10k  [RESC1608X55N]
R4  10k  [RESC1608X55N]
R5  1k  [RESC1608X55N]
R6  10k  [RESC1608X55N]
R7  1k  [RESC1608X55N]
R8  10k  [RESC1608X55N]
R10  1k  [RESC1608X55N]
R11  10k  [RESC1608X55N]
R12  1k  [RESC1608X55N]
R13  10k  [RESC1608X55N]
R42  1k  [RESC1608X55N]
R43  1k  [RESC1608X55N]
R44  1k  [RESC1608X55N]
R46  10k  [RESC1608X55N]
R47  10k  [RESC1608X55N]
R48  10k  [RESC1608X55N]
R55  1k  [RESC1608X55N]
R56  10k  [RESC1608X55N]
R57  1k  [RESC1608X55N]
R58  10k  [RESC1608X55N]
R59  1k  [RESC1608X55N]
R60  10k  [RESC1608X55N]

### Ports
i_adc (in)

### Nets
GND: C4.1 C22.1 IC2.12(V-) IC4.12(V-) IC8.2(A) IC8.3(A) IC8.6(A) IC8.7(A) R13.2
P5V0SB: C4.2 C22.2 IC2.3(V+) IC4.3(V+) LD1.2(A) LD2.2(A) LD3.2(A) LD4.2(A) LD5.2(A) LD6.2(A) LD7.2(A) LD8.2(A) R43.2 R44.2
0.825V: IC2.5(IN+) R6.1 R60.2
0.4125V: IC2.9(IN+) R8.2 R11.1
1.65V: IC4.5(IN+) R4.2 R48.1
1.2375V: IC4.9(IN+) R56.2 R58.1
i_adc: IC2.4(IN-) IC2.6(IN-) IC2.8(IN-) IC2.10(IN-) IC4.4(IN-) IC4.6(IN-) IC4.8(IN-) IC4.10(IN-) ; port i_adc
LED_1/8: LD4.1(C) R12.2
LED_2/8: LD3.1(C) R10.2
LED_3/8: LD2.1(C) R7.2
LED_4/8: LD1.1(C) R5.2
LED_5/8: LD8.1(C) R59.2
LED_6/8: LD7.1(C) R57.2
LED_7/8: LD6.1(C) R55.2
LED_8/8: LD5.1(C) R42.2
P2V5REF: IC8.1(C) IC8.8(REF) R43.1 R44.1 R46.1
NetIC2_1: IC2.1(OUT) R7.1
NetIC2_2: IC2.2(OUT) R5.1
NetIC2_7: IC2.7(IN+) R6.2 R8.1
NetIC2_11: IC2.11(IN+) R11.2 R13.1
NetIC2_13: IC2.13(OUT) R12.1
NetIC2_14: IC2.14(OUT) R10.1
NetIC4_1: IC4.1(OUT) R55.1
NetIC4_2: IC4.2(OUT) R42.1
NetIC4_7: IC4.7(IN+) R48.2 R56.1
NetIC4_11: IC4.11(IN+) R58.2 R60.1
NetIC4_13: IC4.13(OUT) R59.1
NetIC4_14: IC4.14(OUT) R57.1
NetR2_1: R2.1 R47.2
NetR2_2: R2.2 R4.1
NetR46_2: R46.2 R47.1

Not connected (* = marked no-connect by the designer): IC8 4(NC) 5(NC)

### Library data of the parts
C4 C22 = CC0402_100NF_25V_10%_X7R_YUDEN_TMK105B7104KVHF: as C6 on sheet PWR_stage_AC; Part Number: CC0402_100NF_25V_10%_X7R_YUDEN_TMK105B7104KVHF; Component Kind: Standard; Component Type: Standard; Pin Count: 2; Value: 100nF; Status: Not Recommended; Manufacturer Part Number: TMK105B7104KVHF; Case: 0402; Mounted: Yes; Socket: No; SMD: Yes; Sense: No; HelpURL: \\cern.ch\dfs\Applications\Altium\Datasheets\CC0402_TAIYO-YUDEN_TMK105B7104KVHF.pdf; Author: CERN DEM JLC; CreateDate: 10/05/2017; LatestRevisionDate: 10/05/2017; ComponentHeight: 0.55mm
IC2 IC4 = LM339AD: Quad Operational Amplifier; Part Description: Quad Differential Comparator; Manufacturer: TEXAS INSTRUMENTS; PressFit: No; Bonding: No; Part Number: LM339AD; Component Kind: Standard; Component Type: Standard; Device: LM339AD; PackageDescription: SOIC 14, Pitch 1.27mm - Body 4x8.75mm, IPC Medium Density; Manufacturer Part Number: LM339AD; Pin Count: 14; Case: SOIC14; Mounted: Yes; Socket: No; SMD: Yes; Sense: No; ComponentHeight: 1.75mm; Author: CERN DEM JLC; HelpURL: \\cern.ch\dfs\Applications\Altium\Datasheets\LM339AD.pdf; CreateDate: 09.03.2011; LatestRevisionDate: 09.03.2011
IC8 = TL431CD: Precision Programmable Reference; Part Description: Vref (2.5V) To 36V 2% Precision Programmable Reference; Manufacturer: TEXAS INSTRUMENTS; PressFit: No; Bonding: No; Part Number: TL431CD; Component Kind: Standard; Component Type: Standard; Device: TL431CD; PackageDescription: SOIC 8, Pitch 1.27mm, Body 4x5mm, IPC Medium Density; Manufacturer Part Number: TL431CD; Pin Count: 8; Case: SOIC8; Mounted: Yes; Socket: No; SMD: Yes; Sense: No; ComponentHeight: 1.75mm; HelpURL: \\cern.ch\dfs\Applications\Altium\Datasheets\TL431CD.pdf; Author: CERN DEM JLC; CreateDate: 18.01.2011; LatestRevisionDate: 28.02.2011
LD1-LD8 = LED_AVAGO_HSME-C120: as LD9 on sheet DIOT_PSU_AC_180; Part Number: LED_AVAGO_HSME-C120; Component Kind: Standard; Component Type: Standard; Color: Green; PackageDescription: Green Chip LED, 2-Leads, Body 1.7x1.1mm, Side Emitting Package; Manufacturer Part Number: HSME-C120; Pin Count: 2; Mounted: Yes; Socket: No; SMD: Yes; Sense: No; ComponentHeight: 0.7mm; HelpURL: \\cern.ch\dfs\Applications\Altium\Datasheets\LED_AVAGO_HSME-C120.pdf; ComponentLink1URL: \\cern.ch\dfs\Applications\Altium\Datasheets\LED_AVAGO_HSME-C110_DESIGN-GUIDE.pdf; ComponentLink1Description: Design Guide; Author: CERN DEM JMW; CreateDate: 22.07.2009; LatestRevisionDate: 20.06.2012
R2 R4 R6 R8 R11 R13 R46-R48 R56 R58 R60 = R0603_10K_1%_0.1W_100PPM: Resistor - 1%; Part Description: General Purpose Thick Film Chip Resistor; Manufacturer: GENERIC; Manufacturer1 Part Number: NRC06F1002TRF; Power: 0.1W; TC: ±100ppm/°C; PressFit: No; Part Number: R0603_10K_1%_0.1W_100PPM; Component Kind: Standard; Component Type: Standard; Pin Count: 2; Value: 10k; Status: Preferred; Tolerance: ±1%; Manufacturer Part Number: R0603_10K_1%_0.1W_100PPM; Case: 0603; Mounted: Yes; Sense: No; Socket: No; SMD: Yes; Manufacturer1 Example: NIC COMPONENT; Manufacturer1 ComponentHeight: 0.55mm; HelpURL: \\cern.ch\dfs\Applications\Altium\Datasheets\R0603_NIC_NRC.pdf; Author: CERN DEM JLC; CreateDate: 03.12.2007; LatestRevisionDate: 13.03.2008
R5 R7 R10 R12 R42-R44 R55 R57 R59 = R0603_1K_1%_0.1W_100PPM: as R9 on sheet DIOT_PSU_AC_180; Part Number: R0603_1K_1%_0.1W_100PPM; Component Kind: Standard; Component Type: Standard; Pin Count: 2; Value: 1k; Status: Preferred; Tolerance: ±1%; Manufacturer Part Number: R0603_1K_1%_0.1W_100PPM; Case: 0603; Mounted: Yes; Sense: No; Socket: No; SMD: Yes; Manufacturer1 Example: NIC COMPONENT; Manufacturer1 ComponentHeight: 0.55mm; HelpURL: \\cern.ch\dfs\Applications\Altium\Datasheets\R0603_NIC_NRC.pdf; Author: CERN DEM JLC; CreateDate: 03.12.2007; LatestRevisionDate: 13.03.2008

## Nets that join several sheets
GND: DIOT_PSU_AC_180 (15 pins), PWR_stage_AC (25 pins), Mechanics (R37.1 R38.1), LED_bargraph (9 pins)
P5V0SB: DIOT_PSU_AC_180 (8 pins), PWR_stage_AC (6 pins), LED_bargraph (14 pins)
P12V0_OUT: DIOT_PSU_AC_180 (J2.P8 J2.P9 R21.2), PWR_stage_AC (D5.1 R1.I1)
AC_L: DIOT_PSU_AC_180 (B5.1 J2.P1), PWR_stage_AC (R17.1)
AC_N: DIOT_PSU_AC_180 (B6.1 J2.P2), PWR_stage_AC (R18.1)
i_adc: PWR_stage_AC (C7.2 R45.1), LED_bargraph (8 pins)
NetIC1_4: DIOT_PSU_AC_180 (R15.1 T3.1), PWR_stage_AC (IC1.4)
NetIC3_4: DIOT_PSU_AC_180 (R16.1 T4.1), PWR_stage_AC (IC3.4)
PS-ON: DIOT_PSU_AC_180 (R19.1 T2.3), PWR_stage_AC (T1.1)